# EAGLE board micromouse_board_revB_V0.0.16 (EAGLE 9.4.2)
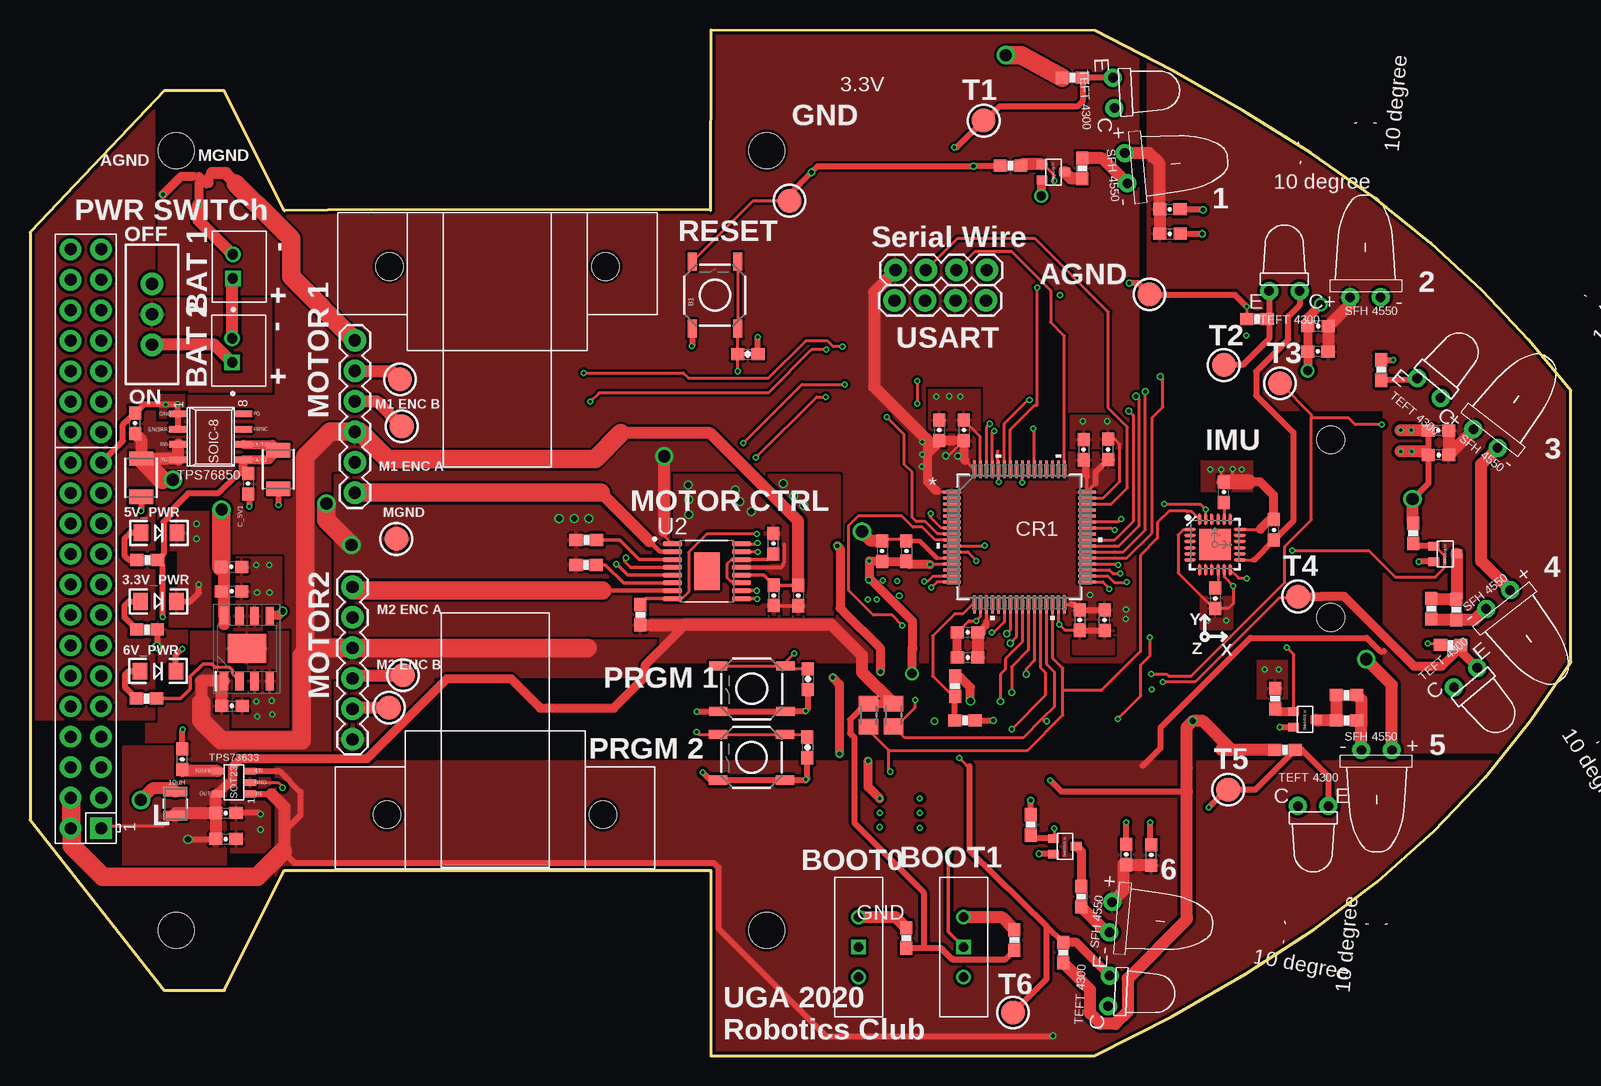
[diagram p5: board, top side]
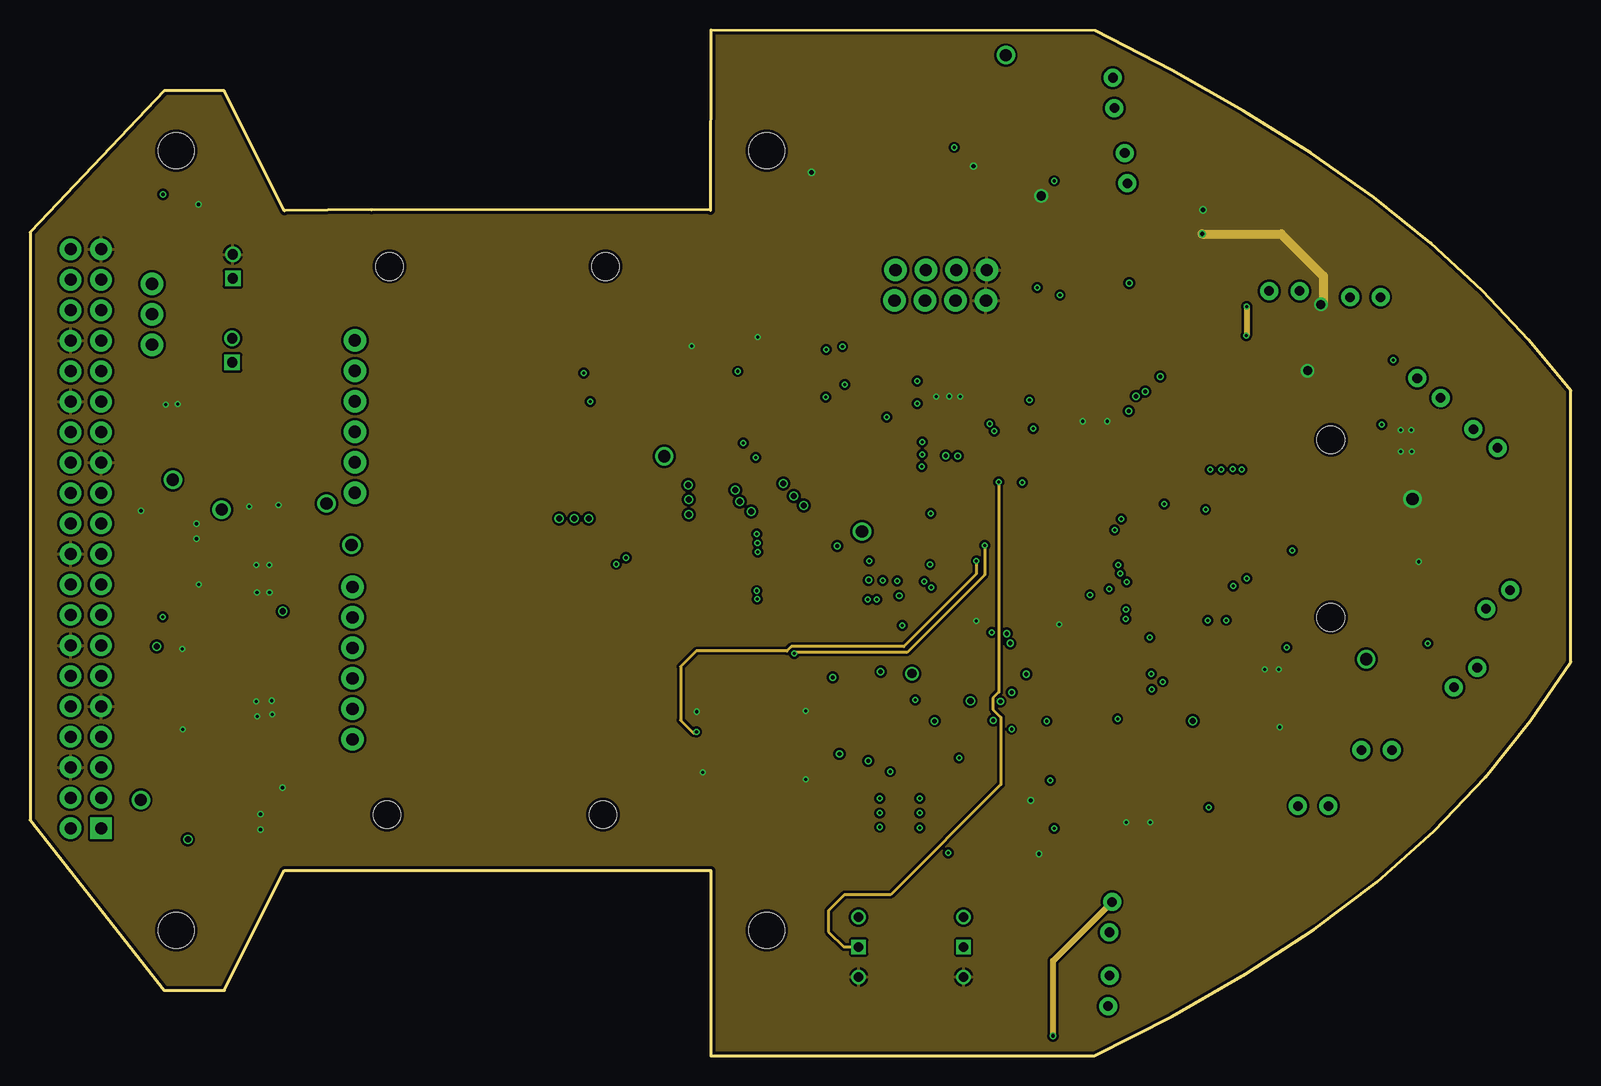
[diagram p6: board, inner layer GND]
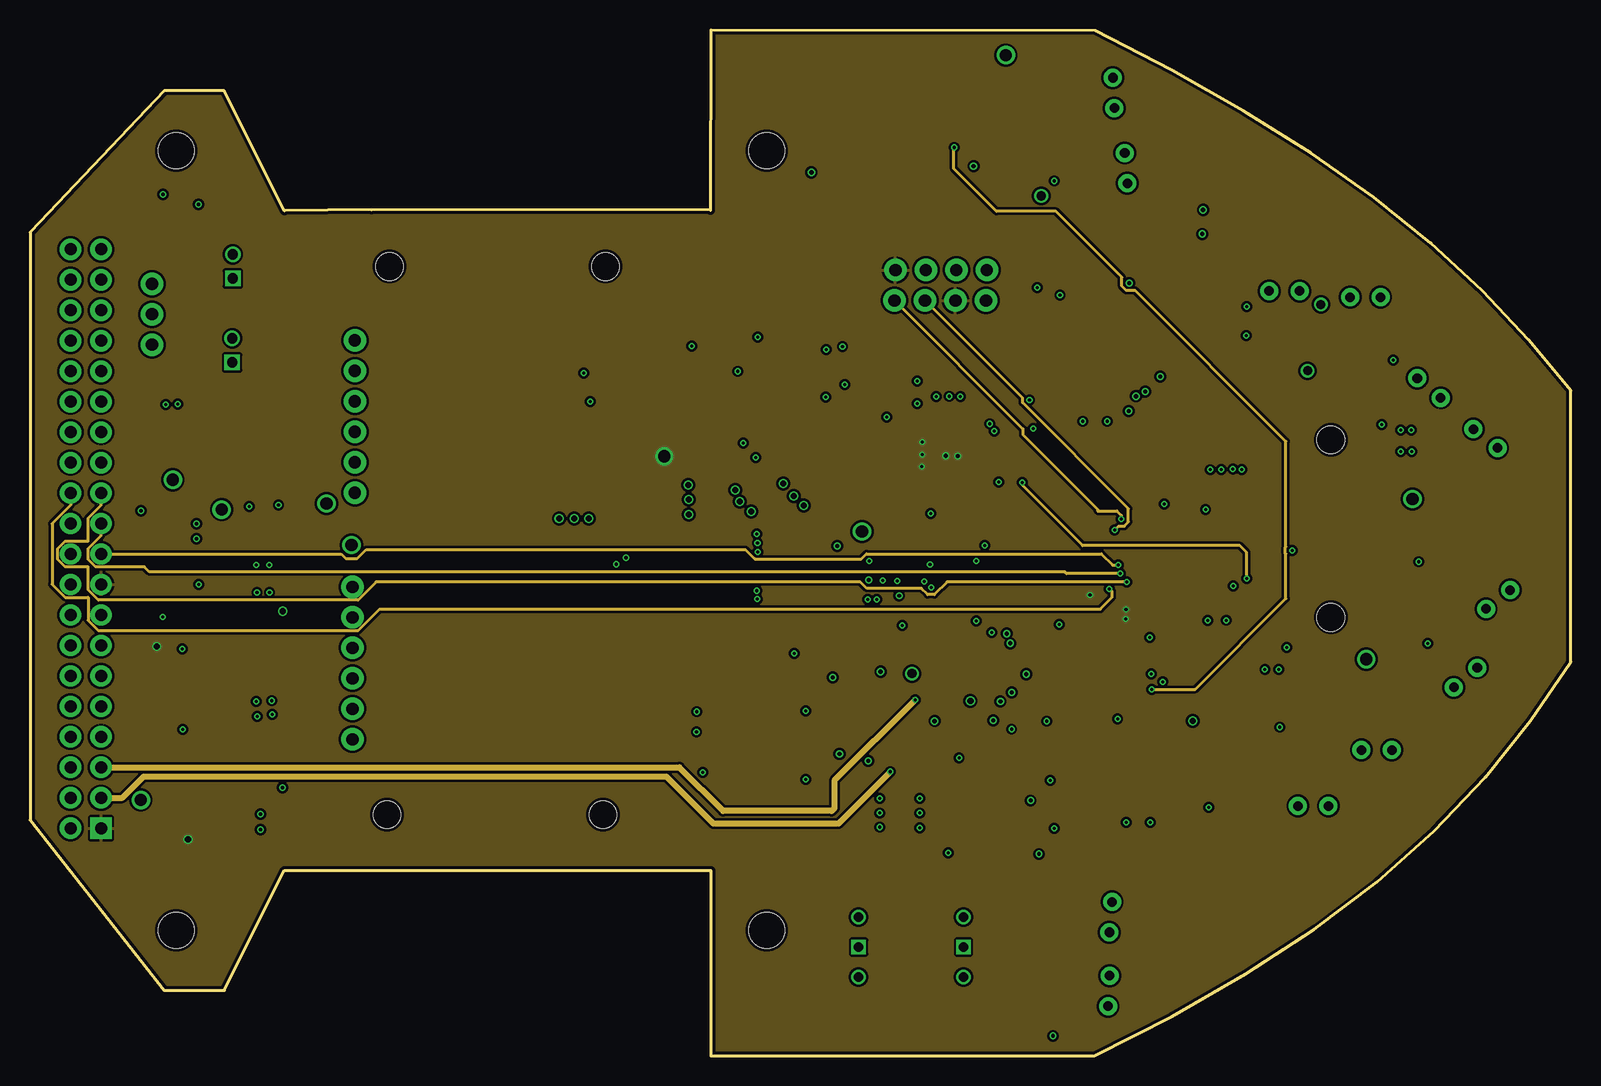
[diagram p7: board, inner layer SIGNAL]
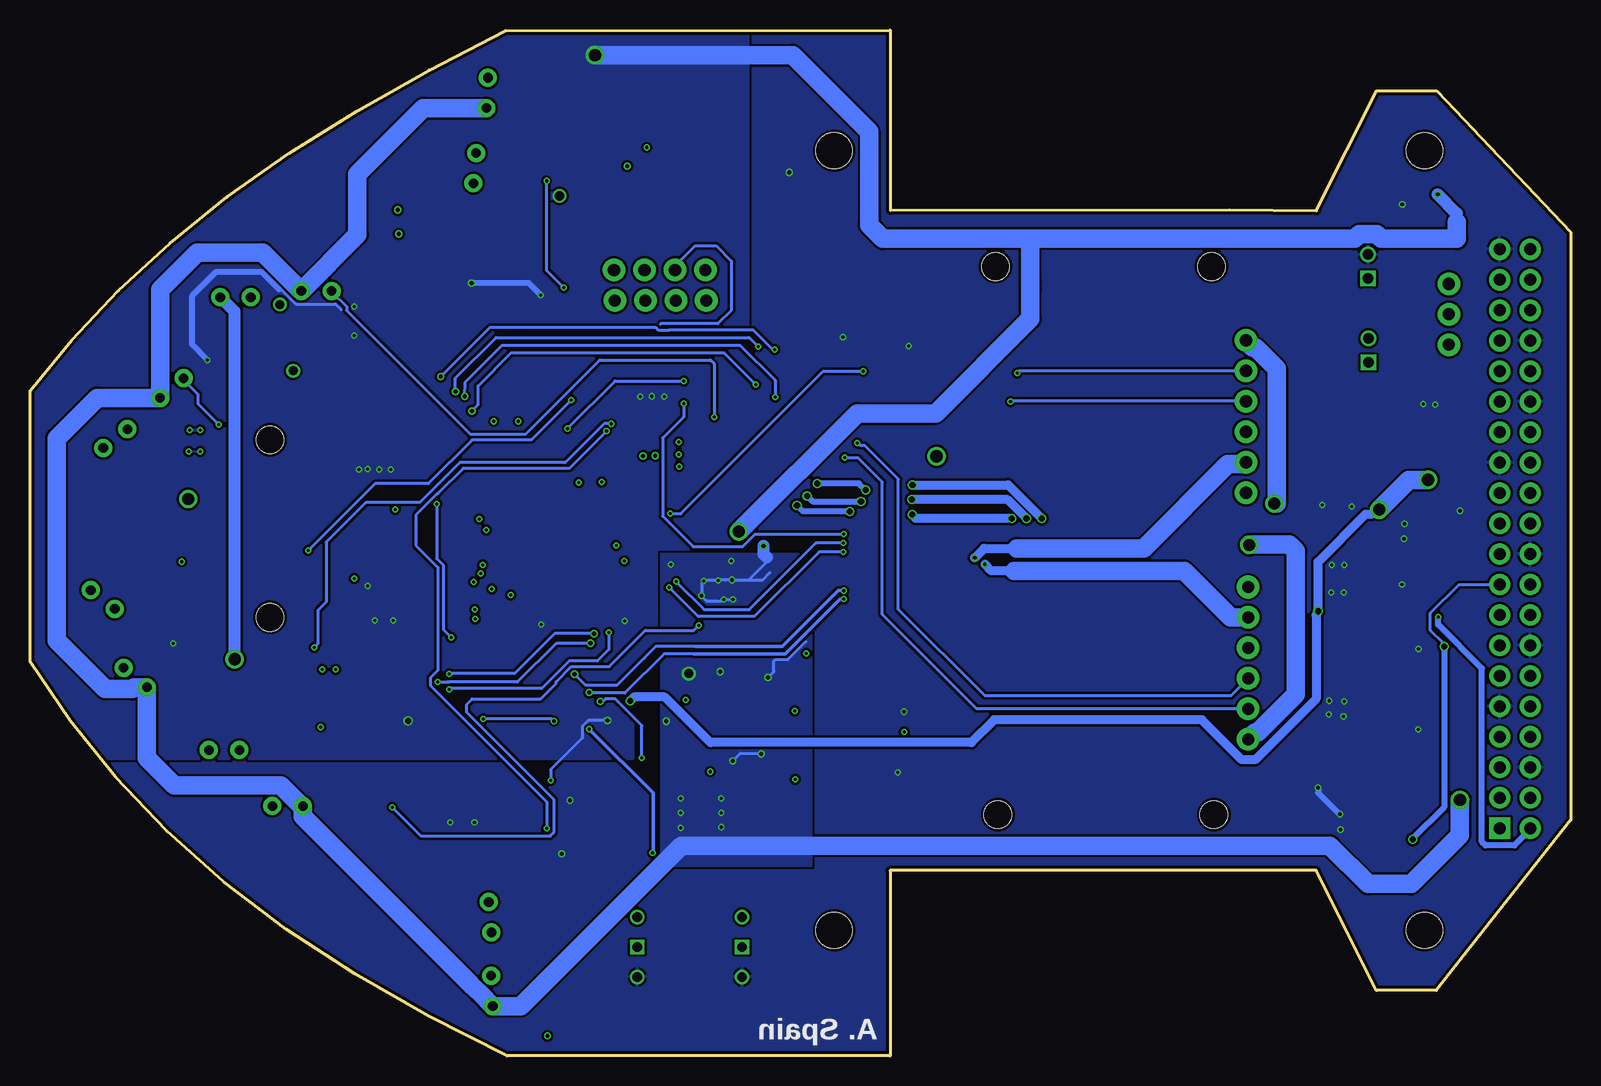
[diagram p8: board, bottom side, seen from below]

Size 128.4 x 85.52 mm. Coordinates in mm from the lower left corner, seen from the top.
Outline: 56.73,15.45 56.73,0 88.67,0 95.19,3.31 101.32,6.82 107.03,10.54 112.27,14.51 117.01,18.73 121.25,23.21 125.04,27.92 128.4,32.85 128.4,55.45 124.91,59.68 121.03,63.79 116.73,67.75 111.98,71.57 106.78,75.24 101.15,78.77 95.14,82.18 88.79,85.47 56.73,85.52 56.71,70.48 28.44,70.53 21.2,70.45 16.19,80.45 11.18,80.45 0,68.65 0,19.65 11.2,5.45 16.2,5.45 21.2,15.45 56.73,15.45
Copper layers (1+2*3+16): PWR 0.018mm / dielectric 0.36mm / GND 0.035mm / dielectric 0.71mm / SIGNAL 0.035mm / dielectric 0.36mm / AGROUND 0.018mm
Design rules "eC_4Layer_PClass6_BaseCopperO18-I35_eCDefault *": minimum track width 10mil, minimum drill 10mil, track to track 0.15mm, track to pad 0.15mm, pad to pad 0.15mm, via to via 0.15mm, smd to smd 0mil, copper to edge 0.25mm, drill to drill 0.35mm, minimum pad ring 0.175mm, minimum via ring 0.125mm, stop-mask expansion 0mil, vias tented up to drill 0.45mm, thermal gap 0.2mm
Net classes: 0 default: width 0.254 mm, drill 0.254 mm, clearance 0.203 mm; 1 5V: width 0.508 mm, drill 0.254 mm, clearance 0.254 mm; 2 6V: width 0.305 mm, drill 0.305 mm, clearance 0.203 mm; 3 6V_S: width 0.229 mm, drill 0.203 mm, clearance 0.203 mm; 4 V_BATT: width 0.762 mm, drill 0.508 mm, clearance 0.254 mm; 5 3.3V: width 0.254 mm, drill 0.254 mm, clearance 0.203 mm; 6 MGND: width 0.305 mm, drill 0.305 mm, clearance 0.254 mm; 7 AGND: width 0.254 mm, drill 0.203 mm, clearance 0.203 mm; 8 GND: width 0.254 mm, drill 0.203 mm, clearance 0.203 mm; 9 M1: width 0.254 mm, drill 0.254 mm, clearance 0.203 mm; 10 M2: width 0.254 mm, drill 0.254 mm, clearance 0.203 mm
Holes 3 mm at 12.2,10.45 12.2,75.45 61.4,10.45 61.4,75.45
Holes 2.3 mm at 108.4,36.55 108.4,51.35 29.75,20.1 47.75,20.1 47.95,65.8 29.95,65.8
tKeepout: area 34.3,15.9 to 43,36.9; area 34.5,49.3 to 43.2,70.3

## Footprints (pad centres in the part's own frame; a part is rotated, then mirrored left to right if it is on the bottom)
LED-1206 = smd 1.2 x 1.4: A -1.5,0; C 1.5,0
TACTILE-SWITCH-SMD = smd 1.524 x 0.762: 1 -2.794,1.905; 2 2.794,1.905; 3 -2.794,-1.905; 4 2.794,-1.905
0603-CAP = smd 1.1 x 1: 1 -0.85,0; 2 0.85,0
1210 = smd 1.2 x 2: 1 -1.6,0; 2 1.6,0
LQFP-64 = smd 1.473 x 0.229: 1 -5.626,3.75; 2 -5.626,3.25; 3 -5.626,2.75; 4 -5.626,2.25; 5 -5.626,1.75; 6 -5.626,1.25; 7 -5.626,0.75; 8 -5.626,0.25; 9 -5.626,-0.25; 10 -5.626,-0.75; 11 -5.626,-1.25; 12 -5.626,-1.75; 13 -5.626,-2.25; 14 -5.626,-2.75; 15 -5.626,-3.25; 16 -5.626,-3.75; 33 5.626,-3.75; 34 5.626,-3.25; 35 5.626,-2.75; 36 5.626,-2.25; 37 5.626,-1.75; 38 5.626,-1.25; 39 5.626,-0.75; 40 5.626,-0.25; 41 5.626,0.25; 42 5.626,0.75; 43 5.626,1.25; 44 5.626,1.75; 45 5.626,2.25; 46 5.626,2.75; 47 5.626,3.25; 48 5.626,3.75 | smd 0.229 x 1.473: 17 -3.75,-5.626; 18 -3.25,-5.626; 19 -2.75,-5.626; 20 -2.25,-5.626; 21 -1.75,-5.626; 22 -1.25,-5.626; 23 -0.75,-5.626; 24 -0.25,-5.626; 25 0.25,-5.626; 26 0.75,-5.626; 27 1.25,-5.626; 28 1.75,-5.626; 29 2.25,-5.626; 30 2.75,-5.626; 31 3.25,-5.626; 32 3.75,-5.626; 49 3.75,5.626; 50 3.25,5.626; 51 2.75,5.626; 52 2.25,5.626; 53 1.75,5.626; 54 1.25,5.626; 55 0.75,5.626; 56 0.25,5.626; 57 -0.25,5.626; 58 -0.75,5.626; 59 -1.25,5.626; 60 -1.75,5.626; 61 -2.25,5.626; 62 -2.75,5.626; 63 -3.25,5.626; 64 -3.75,5.626
1X04 = drill 1.016 pad 1.88: 1 0,0; 2 2.54,0; 3 5.08,0; 4 7.62,0
JST_B2B-PH-K-S(LF)(SN) = drill 0.86 square: 1 1,-0.55 | drill 0.86: 2 -1,-0.55
1007 = smd 2 x 0.8: 1 0,1; 2 0,-1
EMITTER = drill 0.8 pad 1.5: + -1.27,-0.5; - 1.27,-0.5
DMN3150LW = smd 0.7 x 0.9: D 0,0.95; G -0.65,-0.95; S 0.65,-0.95
M0805 = smd 1.3 x 1.6: 1 -0.95,0; 2 0.95,0
0603-RES = smd 1.1 x 1: 1 -0.85,0; 2 0.85,0
RECEIVER = drill 0.8 pad 1.5: C 1.27,-0.5; E -1.27,-0.5
SWITCH-SPDT = drill 1.016 pad 1.88: 1 0,2.54; 2 0,0; 3 0,-2.54
TESTPOINT_ROUND_2MM = smd 2 x 2: P$1 0,0
SOP65P640X120-17N = smd 1.57 x 0.41: 1 -2.87,2.275; 2 -2.87,1.625; 3 -2.87,0.975; 4 -2.87,0.325; 5 -2.87,-0.325; 6 -2.87,-0.975; 7 -2.87,-1.625; 8 -2.87,-2.275; 9 2.87,-2.275; 10 2.87,-1.625; 11 2.87,-0.975; 12 2.87,-0.325; 13 2.87,0.325; 14 2.87,0.975; 15 2.87,1.625; 16 2.87,2.275 | smd 2.105 x 3.115: 17 0,0
QFN-24-EP = smd 1.016 x 0.254: 1 -2.066,1.257; 2 -2.066,0.75; 3 -2.066,0.247; 4 -2.066,-0.287; 5 -2.066,-0.792; 6 -2.066,-1.297; 13 2.086,-1.297; 14 2.086,-0.792; 15 2.086,-0.287; 16 2.086,0.247; 17 2.086,0.75; 18 2.086,1.257 | smd 0.254 x 1.016: 7 -1.267,-2.122; 8 -0.762,-2.122; 9 -0.258,-2.122; 10 0.278,-2.122; 11 0.78,-2.122; 12 1.287,-2.122; 19 1.287,2.082; 20 0.78,2.082; 21 0.278,2.082; 22 -0.258,2.082; 23 -0.762,2.082; 24 -1.267,2.082 | smd 2.616 x 2.616: P$1 0.02,-0.01
TPS73633(SOT-23) = smd 0.55 x 1: EN 0.95,-1.35; GND 0,-1.35; IN -0.95,-1.35; NR/FB 0.95,1.35; OUT -0.95,1.35
TPS76850(SOIC-8) = smd 0.55 x 1.5: EN(BAR) -0.635,-2.7; FB/NC -0.635,2.7; GND -1.905,-2.7; IN1 0.635,-2.7; IN2 1.905,-2.7; OUT1 0.635,2.7; OUT2 1.905,2.7; PG -1.905,2.7
6P_HEADER = drill 1.016 pad 1.88: 1 0,0; 2 2.54,0; 3 5.08,0; 4 7.62,0; 5 10.16,0; 6 12.7,0
SPDT = drill 0.8: P$1 -2.5,0; P$3 2.5,0 | drill 0.8 square: P$2 0,0
SPLITTER = smd 0.102 x 0.102: 1 0,0; 2 0,0
SOIC127P600X100-9N = smd 1.525 x 0.7: 1 -2.712,1.905; 2 -2.712,0.635; 3 -2.712,-0.635; 4 -2.712,-1.905; 5 2.712,-1.905; 6 2.712,-0.635; 7 2.712,0.635; 8 2.712,1.905 | smd 2.4 x 3.2: 9 0,0
RASPI_GPIO_B+_PIN = drill 1 pad 1.778 square: 1 -24.13,-1.27 | drill 1 pad 1.778: 2 -24.13,1.27; 3 -21.59,-1.27; 4 -21.59,1.27; 5 -19.05,-1.27; 6 -19.05,1.27; 7 -16.51,-1.27; 8 -16.51,1.27; 9 -13.97,-1.27; 10 -13.97,1.27; 11 -11.43,-1.27; 12 -11.43,1.27; 13 -8.89,-1.27; 14 -8.89,1.27; 15 -6.35,-1.27; 16 -6.35,1.27; 17 -3.81,-1.27; 18 -3.81,1.27; 19 -1.27,-1.27; 20 -1.27,1.27; 21 1.27,-1.27; 22 1.27,1.27; 23 3.81,-1.27; 24 3.81,1.27; 25 6.35,-1.27; 26 6.35,1.27; 27 8.89,-1.27; 28 8.89,1.27; 29 11.43,-1.27; 30 11.43,1.27; 31 13.97,-1.27; 32 13.97,1.27; 33 16.51,-1.27; 34 16.51,1.27; 35 19.05,-1.27; 36 19.05,1.27; 37 21.59,-1.27; 38 21.59,1.27; 39 24.13,-1.27; 40 24.13,1.27

## Placement (x,y rotation side)
3.3V_PWR  green  [LED-1206]  10.71,37.89 0 top
5V_PWR  green  [LED-1206]  10.74,43.6 0 top
6V_PWR  green  [LED-1206]  10.66,32.07 0 top
B1  [TACTILE-SWITCH-SMD]  57.08,63.41 90 top
B2  [TACTILE-SWITCH-SMD]  60.16,30.6 180 top
B3  [TACTILE-SWITCH-SMD]  60.12,24.89 180 top
C1  10nF  [0603-CAP]  73.04,42.08 270 top
C2  4.7uF  [0603-CAP]  75.77,52.15 270 top
C4  0.1uF  [0603-CAP]  77.82,52.15 270 top
C7  0.1uF  [0603-CAP]  87.48,36.33 270 top
C8  1uF  [0603-CAP]  71.01,42.07 270 top
C17  0.1uF  [0603-CAP]  78.13,35.3 180 top
C18  4.7uF  [0603-CAP]  78.14,33.21 0 top
C21  4.7uF  [0603-CAP]  89.54,36.32 90 top
C22  0.1uF  [0603-CAP]  89.85,50.56 90 top
C23  4.7uF  [0603-CAP]  87.79,50.53 270 top
C_3.3V1  10uF  [0603-CAP]  16.32,20.24 0 top
C_3.3V2  0.1uF  [0603-CAP]  16.32,18.07 0 top
C_3.3V5  1uF  [0603-CAP]  16.83,29.17 0 top
C_3.3V6  10uF  [0603-CAP]  16.79,40.77 0 top
C_3.3V7  0.1uF  [0603-CAP]  16.8,38.72 0 top
C_5V1  0.1uF  [0603-CAP]  18.17,47.7 270 top
C_5V2  47uF  [1210]  20.7,48.88 270 top
C_BAT1  0.1uF  [0603-CAP]  8.75,52.73 90 top
C_BAT2  47uF  [1210]  9.25,48.19 270 top
C_D  0.1uF  [0603-CAP]  61.98,38.38 270 top
C_D1  10uF  [0603-CAP]  64.02,38.37 270 top
C_D2  2.2uF  [0603-CAP]  61.95,42.69 90 top
C_E_H1  4.7uF  [0603-CAP]  107.33,60.83 180 top
C_E_H2  0.1uF  [0603-CAP]  107.32,58.73 180 top
C_ELF1  4.7uF  [0603-CAP]  95,68.52 0 top
C_ELF2  0.1uF  [0603-CAP]  94.99,70.57 0 top
C_EM_D1  4.7uF  [0603-CAP]  117.38,50.08 180 top
C_EM_D2  0.1uF  [0603-CAP]  117.37,52.14 180 top
C_ERF1  4.7uF  [0603-CAP]  91.36,16.79 90 top
C_ERF2  0.1uF  [0603-CAP]  93.44,16.74 90 top
C_NR  0.1uF  [0603-CAP]  12.69,24.72 90 top
C_NRST  0.1uF  [0603-CAP]  59.82,58.5 0 top
C_NRST1  0.1uF  [0603-CAP]  64.83,31.4 270 top
C_NRST2  0.1uF  [0603-CAP]  64.79,25.71 270 top
CR1  STM32F103RET6  [LQFP-64]  82.45,43.26 0 top
IMU_C1  0.1uF  [0603-CAP]  98.77,38.14 270 top
IMU_C2  0.1uF  [0603-CAP]  103.66,43.85 90 top
IMU_C3  2.2nF  [0603-CAP]  99.5,46.99 90 top
J1  [1X04]  79.74,65.51 180 top
J2  JST_PH  [JST_B2B-PH-K-S(LF)(SN)]  17.45,65.8 270 top
J3  JST_PH  [JST_B2B-PH-K-S(LF)(SN)]  17.4,58.8 270 top
J4  [1X04]  79.66,62.96 180 top
L1  10uH  [1007]  12.12,21.02 180 top
LEFT_FRONT_EMITTER  EMITTER  [EMITTER]  91.83,74.05 275 top
NMOS1  DMN3150LW  [DMN3150LW]  85.28,73.67 270 top
NMOS2  DMN3150LW  [DMN3150LW]  117.94,41.84 270 top
NMOS3  DMN3150LW  [DMN3150LW]  86.24,17.47 270 top
NMOS4  DMN3150LW  [DMN3150LW]  106.24,28.04 270 top
R4  4.7k  [M0805]  71.96,28.41 90 top
R5  4.7k  [M0805]  69.87,28.4 90 top
R_B1  47k  [0603-RES]  73.01,9.82 270 top
R_B2  47k  [0603-RES]  82.04,9.64 270 top
R_ED1  5.6  [0603-RES]  116.77,37.27 270 top
R_ED2  5.6  [0603-RES]  118.86,37.19 270 top
R_ED_PD  47k  [0603-RES]  115.25,43.55 270 top
R_EH1  5.6  [0603-RES]  109.7,27.95 0 top
R_EH2  5.6  [0603-RES]  109.71,30.06 0 top
R_EH_PD  47k  [0603-RES]  103.75,29.77 270 top
R_ELF  10  [0603-RES]  87.68,73.98 90 top
R_ELF_PD  47k  [0603-RES]  81.71,74.2 0 top
R_ERF  10  [0603-RES]  87.61,13.27 270 top
R_ERF_PD  47k  [0603-RES]  83.41,19.25 270 top
R_PWR1  150 Ohm  [0603-RES]  9.77,41.34 0 top
R_PWR3  150 Ohm  [0603-RES]  9.7,29.78 0 top
R_PWR4  150 Ohm  [0603-RES]  9.75,35.52 0 top
R_RLD  1.8k  [0603-RES]  112.59,57.17 270 top
R_RLF  1.8k  [0603-RES]  86.86,81.55 0 top
R_RLH  1.8k  [0603-RES]  102.24,61.43 0 top
R_RRD  1.8k  [0603-RES]  118.38,34.23 0 top
R_RRF  1.8k  [0603-RES]  86.1,8.61 90 top
R_RRH  1.8k  [0603-RES]  104.59,25.51 0 top
R_VM1  75k  [0603-RES]  77.09,30.8 90 top
R_VM2  50k  [0603-RES]  77.9,27.96 180 top
R_VM3  500m  [0603-RES]  46.35,40.93 180 top
R_VM4  500m  [0603-RES]  46.36,42.99 180 top
R_VM5  10k  [0603-RES]  50.87,36.78 270 top
REC_LF  RECEIVER  [RECEIVER]  90.8,80.3 273 top
S2  [SWITCH-SPDT]  10.16,61.82 0 top
T1  [TESTPOINT_ROUND_2MM]  79.47,77.96 90 top
T2  [TESTPOINT_ROUND_2MM]  99.49,57.59 90 top
T3  [TESTPOINT_ROUND_2MM]  104.17,56.07 90 top
T4  [TESTPOINT_ROUND_2MM]  105.67,38.29 90 top
T5  [TESTPOINT_ROUND_2MM]  99.85,22.18 90 top
T6  [TESTPOINT_ROUND_2MM]  81.93,3.61 90 top
TP7  [TESTPOINT_ROUND_2MM]  30.98,52.47 0 top
TP8  [TESTPOINT_ROUND_2MM]  30.83,56.41 0 top
TP9  [TESTPOINT_ROUND_2MM]  31.08,31.72 0 top
TP10  [TESTPOINT_ROUND_2MM]  29.91,29.03 0 top
TP11  [TESTPOINT_ROUND_2MM]  30.52,43.09 0 top
TP12  [TESTPOINT_ROUND_2MM]  93.3,63.47 90 top
TP13  [TESTPOINT_ROUND_2MM]  63.29,71.29 90 top
U2  DRV8848PWPR  [SOP65P640X120-17N]  56.41,40.4 0 top
U6  MPU-6000  [QFN-24-EP]  98.73,42.64 0 top
U$3  TPS73633(SOT-23)  [TPS73633(SOT-23)]  16.99,22.78 90 top
U$4  TPS76850(SOIC-8)  [TPS76850(SOIC-8)]  15.07,51.6 270 top
U$5  6P_HEADER  [6P_HEADER]  26.88,39.09 270 top
U$6  6P_HEADER  [6P_HEADER]  27.07,46.94 90 top
U$7  RECEIVER  [RECEIVER]  116.9,56.05 320 top
U$8  RECEIVER  [RECEIVER]  119.95,31.15 220 top
U$9  RECEIVER  [RECEIVER]  90.4,5.38 267 top
U$11  EMITTER  [EMITTER]  121.6,51.85 322 top
U$13  EMITTER  [EMITTER]  90.56,11.52 265 top
U$14  SPARKFUN-SPDT  [SPDT]  69.05,9.07 270 top
U$15  SPARKFUN-SPDT  [SPDT]  77.79,9.07 270 top
U$16  SPLITTER  [SPLITTER]  14.05,72.72 0 top
U$17  EMITTER  [EMITTER]  122.65,37.65 218 top
U$18  EMITTER  [EMITTER]  111.28,63.75 0 top
U$19  EMITTER  [EMITTER]  112.22,24.99 180 top
U$20  RECEIVER  [RECEIVER]  106.94,20.33 180 top
U$21  RECEIVER  [RECEIVER]  104.53,64.26 0 top
U$22  SPLITTER  [SPLITTER]  14.07,73.33 0 top
U$23  BD60HC5WEFJ  [SOIC127P600X100-9N]  18.08,33.95 90 top
X1  RASPI_GPIO_B+#_PIN  [RASPI_GPIO_B+_PIN]  4.65,43.1 90 top

## Tracks (layer width: path | path; a pad name or v marks a point on that pad's centre or on a via)
3.3V  (via drill 0.25, 0.35, 0.51, 1.02)
  PWR 0.254: CR1.1 75.69,47.01 | 79.7,36.31 CR1.19 79.7,36.18 | CR1.32 86.78,37.63 | 79.7,36.11 79.7,36.01 C17.1 | 75.91,8.96 76.15,8.96 76.95,8.16 | 73.13,8.96 R_B1.2 | 52.83,43.57 52.81,43.57 52.83,43.78 | X1.1 5.98,19.12 11.06,19.12 11.7,19.76 L1.1 | C18.2 79.01,33.25 79.09,33.31 | C7.1 87.74,37.38 87.74,37.28 | CR1.64 77.92,49.66 77.92,49.72 | U2.1 52.83,43.38 52.83,43.78 | C2.2 C4.2 76.55,50.03 v76.3,50.03
  PWR 0.305: 88.81,47.75 CR1.48 88.07,48.32 | 87.94,49.53 C23.2
  PWR 0.508: L1.1 11.88,19.78 | R_PWR4.2 10.6,34.29 10.61,34.28 10.61,34.18 v10.56,34.13 | v13.16,18.04 15.44,18.04 C_3.3V2.1 | 52.83,43.57 52.83,43.78 | C21.2 89.54,37.18 C7.1 87.03,37.63 86.78,37.63 | 75.69,47.01 75.63,47.01 75.5,47.14 | 87.94,49.53 87.94,48.46 88.07,48.32 88.07,49.4 C23.2 | 88.81,47.75 88.81,48.67 C22.1 | C17.1 79.7,36.02 | 79.7,36.02 79.7,36.11 79.7,36.18 | 79.18,35.3 79.7,35.82 79.7,36.02 | 76.9,8.11 77,8.01 | R_B2.2 81.25,8.01 77,8.01 | 77,8.01 76.87,8.01 75.91,8.96 74.47,8.96 | 74.47,8.96 73.13,8.96 | R5.2 69.85,29.37 69.69,29.37 68.34,28.01 68.34,26.89 68.69,26.53 68.69,19.42 70.74,17.36 70.72,17.36 74.47,13.62 74.47,8.96 | 35.63,31.42 35.53,31.32 | v74.34,51.17 74.67,51.17 74.8,51.3 | v74.34,50.13 74.75,50.13 74.8,50.18 | v74.31,49.14 74.75,49.14 74.8,49.19
  PWR 0.762: 75.12,50.98 75.45,50.98 C2.2 77.05,51.3 | 75.5,47.14 74.8,47.84 74.8,49.19 74.8,50.18 | 74.8,50.18 74.8,51.3 | R4.2 R5.2 | 54.6,35.93 51.27,32.6 51.27,31.61 48.66,29 42.51,29 40.09,31.42 35.63,31.42 34.74,31.42 28.08,24.76 17.52,24.76 16.88,24.13 16.88,22.7 16.5,22.7 U$3.OUT | 74.8,50.18 75.92,51.3 C4.2 77.82,49.76 77.92,49.66
  PWR 1.016: J1.4 72.12,65.44 70.34,63.67 70.34,55.76 74.8,51.3 75.12,50.98 | C_3.3V1.1 C_3.3V2.1 | L1.1 12.12,20.24 C_3.3V1.1 | 52.83,49.8 52.83,43.78 | R_VM5.2 54.6,35.93 66.79,35.93 69.32,33.41 69.32,32 R4.2 | 79.18,35.3 C17.1 C18.2 | C_3.3V1.1 15.47,21.66 U$3.OUT
  AGROUND 0.254: X1.17 5.98,39.28 9.31,39.28 11.7,36.9 11.7,35.47 10.58,34.36 v10.56,34.13
  AGROUND 0.508: v10.56,34.13 10.56,20.72 13.2,18.07 v13.16,18.04
  other vias: 52.85,49.98 88.33,38.42 91.33,37.22 91.31,36.41 77.31,50
  pour PWR (rank 3): 14.6,22.98 14.6,20.51 10.38,20.51 10.38,12.97 16.2,12.97 16.2,22.98
  pour PWR (rank 3): 7.26,93.01 7.26,32.83 92.37,32.83 92.37,93.01
  pour PWR: 7.92,25.67 16.15,25.67 16.15,2.33 7.92,2.33
  pour SIGNAL: -8.57,98.67 -8.57,-7.94 65.55,-7.94 141.45,-7.94 141.45,100.47 -8.57,100.47
5V  (via drill 0.25, 0.3)
  PWR 0.508: U$3.IN 19.79,21.83 19.79,21.82 20.14,21.8 | C_5V1.1 17.33,48.55 15.66,46.88 13.18,46.88 11.8,45.51 11.8,45.19 11.13,44.51 11.13,41.85 R_PWR1.2 10.74,41.19 11.06,40.87 v11.06,36.58 | X1.4 3.44,21.5 3.44,19.12 X1.2 3.44,18.8 | 20.27,16.26 21.06,17.06 22.04,16.08 56.99,16.08 57.36,15.71 57.36,10.63 66.35,1.64 85.26,1.64 v85.26,1.67 | 112.82,33.73 112.5,33.73 111.39,34.84 101.71,34.84 94.19,27.33 94.19,25.64 92.73,24.17 | U$3.EN 20.8,23.73 22.52,22.01 22.52,20.05 21.35,18.89 21.23,18.89 | 20.43,15.95 20.19,16.18
  PWR 0.762: 20.11,50.48 C_5V2.1 | U$4.OUT1 20.21,50.97 C_5V2.1 | C_5V2.1 19.91,49.7 U$4.OUT2 17.77,48.95 C_5V1.1
  PWR 1.016: C_EM_D2.1 118.23,52.13 C_EM_D1.1 120.29,52.14 U$11.+ | C_ERF2.1 93.44,15.94 C_ERF1.1 91.28,16.01 91.11,16.01 91.11,13.77 U$13.+ | U$18.+ 110.01,62.65 C_E_H1.1 108.18,58.74 C_E_H2.1 | LEFT_FRONT_EMITTER.+ 93.24,75.27 94.14,74.37 C_ELF2.1 C_ELF1.1 | 21.06,17.06 21.23,17.22 21.23,18.89 21.23,20.72 20.14,21.8
  PWR 1.524: X1.4 3.44,21.45 3.44,18.8 | X1.2 3.48,18.87 3.48,17.48 6.04,14.92 18.93,14.92 20.19,16.18 21.06,17.06
  GND 0.508: v85.26,1.67 85.26,7.92 U$13.+
  AGROUND 0.508: v11.06,36.58 11.06,35.95 7.41,32.3 7.41,17.85 7.09,17.53 4.71,17.53 3.28,18.96 X1.2
  pour PWR: 20.49,24.55 20.49,-3.9 134.64,-3.9 134.64,24.55
  pour PWR: 93.16,86.36 93.16,53.89 112.82,53.89 112.82,25.34 131.92,25.34 131.92,86.9
6V
  PWR 0.305: U2.12 61.14,40.07 C_D.1 61.99,39.22 C_D1.1
  PWR 0.762: 14.27,29.83 14.27,29.47
  PWR 1.016: 14.27,29.83 14.27,31.24 U$23.1 15.98,31.24 C_3.3V5.1 | C_D1.1 64.02,44.57 56.69,51.91 49.24,51.91
  PWR 1.524: 14.27,29.47 14.27,27.98 15.94,26.3 22.65,26.3 22.65,33.35 22.93,33.63 | 22.93,33.63 23.3,34.01 U$5.3 46.47,34.01 | 22.93,33.63 22.93,49.95 25,52.02 U$6.3 27.48,52.02 29.76,49.75 47.08,49.75 49.24,51.91
  pour PWR (rank 4): 9.69,87.51 9.69,-3.9 33.6,-3.9 33.6,89.02 9.85,89.02
  pour PWR: 25.19,34.48 74.39,34.48 74.39,31.71 25.16,31.71 25.16,34.48
6V_S
  PWR 0.254: U$23.2 16.9,31.78 16.9,32.16 16.68,32.38 15.43,32.38
  PWR 0.305: R_PWR3.2 12.56,29.78 13.35,30.57 13.35,31.62 13.89,32.15 13.94,32.15 14.44,32.65 15.16,32.65 15.43,32.38
A3.3V  (via drill 0.25, 0.3, 0.35, 0.76, 1.02)
  PWR 0.254: CR1.13 76.77,40.96 v75,40.96 | 102.18,57.06 104.82,59.7 104.88,59.76 104.88,61.69 | 103.77,43.09 IMU_C2.1 | U6.13 102,41.34 | 67.65,37.19 67.73,37.1
  PWR 0.305: 73.23,41.01 73.16,41.08 73.16,41.1 C1.2
  PWR 0.508: 102,41.34 IMU_C2.1 | U$21.C 105.8,62.6 104.88,61.69 104.82,61.62 104.82,59.7 | 104.88,59.76 102.18,57.06 102.18,55.06 105.28,51.96 105.28,44.6 103.77,43.09
  PWR 0.762: C1.2 C8.2 70.97,41.26 v69.94,41.26 69.94,39.82 73.52,36.24 73.52,34 | v75,40.96 73.28,40.96 73.16,41.08 | v67.28,42.51 67.5,42.29 67.5,37.33 67.65,37.19 | 67.73,37.1 70.88,33.95 70.88,32.04 | v66.9,31.54 67.46,30.98 v67.46,25.17 | 73.52,34 73.58,33.95 | v73.5,31.87 73.5,33.98 73.52,34 | v70.81,21.45 69.84,22.42 v69.84,24.58
  PWR 1.016: L1.2 11.85,22.29 10.2,22.29 v9.24,21.32
  AGROUND 0.254: v69.84,24.58 69.21,25.21 67.46,25.21 v67.46,25.17 | v66.9,31.54 66.41,32.02 66.41,32.91 66.29,33.03 65.25,33.03 63.75,34.53 | v69.89,39.66 67.35,39.66 66.74,40.27 | v69.89,39.66 68.52,39.66 67,41.19 67,41.54 | v69.89,39.66 71.04,39.66 v71.06,39.64 72.2,39.64 v72.26,39.59 72.43,39.41 v72.43,38.34 72.03,37.94 70.68,37.94 v70.58,38.04 v69.82,38.04
  AGROUND 1.016: v67.28,42.51 67.28,41.82 67,41.54
  AGROUND 1.524: v9.24,21.32 9.24,18.38 13.3,14.31 16.88,14.31 20.08,17.51 74.11,17.51 87.48,4.14 U$9.C 90.93,5.23 91.65,5.88 91.65,5.95 105.67,19.97 U$20.C 105.78,20.83 107.5,22.54 116.37,22.54 118.66,24.82 U$8.C 119.73,30.72 119.87,30.58 122.13,30.58 126.18,34.63 126.18,51.47 122.8,54.85 U$7.C 117.55,63.86 114.45,66.97 109,66.97 U$21.C 101.11,68.45 101.11,73.52 95.62,79.01 REC_LF.C
  other vias: 70.81,20.23 70.81,19.06 74.16,21.45 74.16,20.23 74.16,19.01 75.38,27.9 70.88,32.02
  pour AGROUND: 63.29,41.85 75.79,41.85 75.79,15.84 63.29,15.84
AGND  (via drill 0.25, 0.3, 0.35, 0.51, 1.02)
  PWR 0.254: 75.55,41.51 CR1.12 | 101.39,43.89 U6.18 102.51,43.89 102.53,43.92 | 103.77,25.63 R_RRH.1 | v116.47,34.36 117.42,34.36 R_RRD.1 | v101.39,62.46 101.39,61.51 R_RLH.1 | C1.1 72.46,43.09 71.23,43.09 C8.1 | 103.27,44.65 103.29,44.68 IMU_C2.2 | 92.34,64.43 93.17,63.6 TP12.P$1 100.38,63.47 100.39,63.46 | U6.1 96.61,43.84 96.09,43.84 95.68,43.43 95.68,40.25 98.63,37.29 IMU_C1.2 99.86,37.29 100.27,37.71 v100.27,39.18 99.51,39.95 U6.11 | v99.28,48.88 99.28,48.05 IMU_C3.2 100.25,48.59 v100.25,48.91 | 96.18,23.4 96.18,23.74 96.41,23.97 | 11.09,71.85 v11.09,71.82
  PWR 0.305: 13.61,73.33 U$22.2
  PWR 0.381: C1.1 74.13,42.93 75.55,41.51
  PWR 0.508: R_VM2.1 v80.28,27.96 | 96.41,11.62 96.41,11.38 | v101.39,62.46 100.42,63.43 | 100.42,63.43 100.39,63.46 | 100.42,63.43 93.34,63.43 93.17,63.6 | TP12.P$1 92.34,64.43 v91.61,64.43 | R_RLD.1 v113.61,58.02 v113.61,58.01 | 96.41,22.01 85.97,22.01 v85.01,22.98
  PWR 0.762: 102.53,43.92 103.27,44.65 | IMU_C2.2 103.62,44.73 103.62,46.72 102.51,47.84 101.57,47.84 | v11.09,71.82 12.61,73.33 13.61,73.33
  PWR 1.016: C1.1 73,42.89 | v69.33,43.71 69.33,43.66 70.07,42.92 C8.1 | R_RRH.1 100.15,25.51 | 99.24,25.51 100.15,25.51 | 96.41,11.62 96.41,22.01 96.41,23.97 96.41,27.42 v96.89,27.9 97.75,27.9 100.15,25.51 | R_RRF.1 88.35,5.51 88.35,3.52 89.22,2.65 90.46,2.65 91.46,3.66 91.46,6.43 96.41,11.38
  PWR 1.27: 101.57,47.84 IMU_C3.2
  PWR 1.524: R_RLF.1 82.59,83.43 v81.32,83.43
  GND 0.508: v101.39,62.46 101.39,60.03 v101.37,60.03
  AGROUND 0.254: 45.03,64.52 45.03,63.87 | 113.77,58.01 v113.61,58.01 | 102.48,62.19 102.96,62.67 106.25,62.67 108.9,65.32 109.03,65.32 | v80.28,27.96 81.89,27.96 82.38,27.47 82.38,26.5 85.01,23.86 v85.01,22.98
  AGROUND 0.305: 9.49,69.49 9.49,70.22
  AGROUND 0.508: v80.28,27.96 v80.28,27.95 | v85.83,63.41 86.85,64.43 v91.61,64.43 | v113.61,58.01 114.88,59.28 114.88,63.36 112.92,65.32 109.08,65.32 107.66,63.9
  AGROUND 1.016: 9.49,70.22 v11.09,71.82
  AGROUND 1.524: v81.32,83.43 64.84,83.43 58.47,77.05 58.47,69.26 57.32,68.11 45.03,68.11 | 45.03,68.11 18.01,68.11 17.61,68.51 16.19,68.51 15.79,68.11 9.49,68.11 9.49,69.49 | 45.03,68.11 45.03,64.52 45.03,63.87 45.03,61.46 52.93,53.56 59.48,53.56 v69.33,43.71
  other vias: 99.69,36.31 98.14,36.28 100.98,48.88 98.34,48.86
  pour AGROUND: 130.4,85.18 130.4,24.78 78.15,24.78 78.15,58.21 68.55,58.21 68.55,85.18
  pour PWR: 101.85,49.53 101.85,47.08 97.63,47.08 97.63,49.58
  pour PWR: 97.55,38.27 100.2,38.27 100.2,35.57 97.55,35.57
BOOT0  (via drill 0.25)
  PWR 0.254: 80.66,50.46 80.66,48.93 CR1.60 80.7,47.83 80.71,47.82 v80.74,47.85
  GND 0.254: v80.74,47.85 80.74,30.32 80.24,29.82 80.24,28.89 80.91,28.22 80.91,22.61 71.72,13.43 67.86,13.43 66.54,12.1 66.54,10.35 67.83,9.07 U$14.P$2
BOOT1  (via drill 0.25)
  PWR 0.254: CR1.28 84.2,32.36 84.6,31.95 84.6,30.04 v81.79,27.23
  PWR 0.305: v76.52,16.91 76.52,10.34 U$15.P$2
  AGROUND 0.305: v81.79,27.23 76.47,21.91 76.47,16.96 v76.52,16.91
BRIDGE_A_1  (via drill 0.25)
  PWR 0.254: U2.16 60.56,42.67 v60.62,42.74 | CR1.15 76.78,39.97 75.23,39.97 74.82,39.55 v74.53,39.55
  AGROUND 0.254: v60.62,42.74 62.91,42.74 68.45,37.2 72.23,37.2 74.53,39.5
  AGROUND 0.305: v74.53,39.55 74.53,39.5
BRIDGE_A_2  (via drill 0.25)
  PWR 0.254: CR1.16 75.6,39.51 v75.12,39.03 | U2.15 60.64,42.02
  PWR 0.305: v60.64,42.01 60.64,42.02
  AGROUND 0.254: v60.64,42.01 62.65,42.01 68.03,36.63 72.72,36.63 v75.12,39.03
BRIDGE_B_1  (via drill 0.25, 0.35)
  PWR 0.254: CR1.26 83.2,33.82 81.81,32.42 v81.81,30.3
  PWR 0.305: 59.43,38.12 U2.9 60.59,38.12 | 60.6,38.11 60.59,38.12 | 60.59,38.12 60.59,38.08 v60.6,38.07
  AGROUND 0.254: 73.07,33.52 75.56,33.52 78.78,30.3 | 78.78,30.3 78.84,30.24 | v81.81,30.3 78.78,30.3
  AGROUND 0.305: v60.6,38.07 60.9,38.07 65.45,33.52 73.07,33.52
BRIDGE_B_2  (via drill 0.25, 0.35)
  PWR 0.254: CR1.27 83.7,32.95 83,32.25 83,31.84 v83.03,31.81
  PWR 0.305: 59.31,38.73 U2.10 v60.57,38.77
  AGROUND 0.254: 72.92,34.13 76.24,34.13 77.21,33.16 79.44,30.93 82.14,30.93 v83.03,31.81
  AGROUND 0.305: v60.57,38.77 61.06,38.77 65.7,34.13 72.92,34.13
D2_EM
  PWR 1.016: U$17.- 120.41,36.34 R_ED2.2 116.84,36.34 R_ED1.2
D_EM
  PWR 1.016: U$17.+ 120.92,41.24 120.92,49.31 U$11.-
EM_D  (via drill 0.25)
  PWR 0.254: CR1.59 81.2,52.69 | 81.2,52.69 | 81.2,52.69 83.21,54.7 v83.29,54.68 | v105.2,42.14 111.55,42.14 113.77,39.92 117.11,39.92 117.91,40.72 117.91,41.66 117.26,42.3 117.11,42.3 NMOS2.G
  PWR 0.508: NMOS2.G 115.46,42.49 R_ED_PD.2
  AGROUND 0.254: v105.2,42.14 99.64,47.7 95.2,47.7 91.55,51.35 86.63,51.35 v83.29,54.68
EM_H  (via drill 0.25)
  PWR 0.254: v104.72,34.04 105.28,33.48 NMOS4.G | v79.98,52.69 79.7,52.41 CR1.62
  PWR 0.508: NMOS4.G
  PWR 0.762: NMOS4.G 103.99,28.69 R_EH_PD.2
  AGROUND 0.254: v104.72,34.04 104.42,34.35 104.42,37.13 103.72,37.83 103.72,42.82 100.41,46.13 95.92,46.13 92.61,49.44 83.81,49.44 80.56,52.69 v79.98,52.69
EM_LF  (via drill 0.25)
  PWR 0.254: CR1.58 81.7,52.2 83.74,54.24 83.93,54.24 v83.93,64.05 | v85.36,72.94 85.36,73.41 84.72,74.05 NMOS1.G
  PWR 1.016: NMOS1.G 82.69,74.32 R_ELF_PD.2
  AGROUND 0.254: v85.36,72.94 85.36,65.48 v83.93,64.05
EM_RF  (via drill 0.25)
  PWR 0.254: v85.36,18.96 85.36,18.33 NMOS3.G | CR1.61 80.2,51.95 80.38,52.13 80.38,52.1 v80.36,52.07
  PWR 0.508: NMOS3.G 83.41,18.12 R_ERF_PD.2
  AGROUND 0.254: v85.36,18.96 85.36,21.19 95.04,30.87 95.04,31.5 94.41,32.14 94.41,40.71 96.24,42.55 96.24,45.07 94.44,46.87 94.41,46.87 92.32,48.97 83.46,48.97 v80.36,52.07
GND  (via drill 0.25, 0.3, 0.35, 0.76, 1.02)
  PWR 0.254: B1.2 60.25,71.29 TP13.P$1 | NMOS1.S 84.17,72.87 | CR1.63 79.2,51.62 C4.1 | CR1.31 85.7,36.04 85.69,36.03 85.77,35.96 v85.78,35.96 86.26,35.48 C7.2 | CR1.18 79.2,36.61 | 79.2,36.61 79.2,36.6 | C17.2 78.24,36.26 v78.85,36.26 79.2,36.61 | U$3.GND 20.68,22.78 21.07,22.39 v21.05,22.37 | CR1.47 89.44,46.51 90.82,47.89 90.82,50.97 90.38,51.41 C22.2 | U$22.1 14.07,72.74 U$16.1
  PWR 0.305: 14.05,71 v14.04,70.98 13.94,71.08 14.07,71.22 | U$22.1 13.48,73.34 | 14.69,72.71 14.9,72.71
  PWR 0.508: C_ELF2.2 97.71,70.57 v97.76,70.52 | C_ELF1.2 v97.68,68.52 | TP13.P$1 63.29,71.82 v65.12,73.65 65.63,74.16 v78.63,74.16 80.82,74.16 R_ELF_PD.1 | 6V_PWR.C 12.16,33.41 12.67,33.92 v12.69,33.92 | C_NR.2 12.69,27.14 12.72,27.17 v12.72,27.22 | C_NRST1.2 64.83,28.93 v64.66,28.77 64.59,28.7 B2.1 B2.2 55.63,28.7 55.62,28.69 v55.57,28.69 | C_NRST2.2 64.79,23.1 64.61,22.92 64.55,22.98 B3.1 B3.2 56.7,22.98 v56.08,23.61 | C_EM_D2.2 C_EM_D1.2 116.53,47.72 115.23,46.42 | C7.2 89.53,35.48 C21.1 | B1.1 55.17,59.28 55.21,59.25 55.21,59.22 v55.16,59.17 | C_NRST.2 60.65,58.52 v60.65,59.91 | C_5V1.2 18.26,46.76 v18.26,45.81 | C_5V2.2 20.7,45.96 20.72,45.94 v20.71,45.92 | 3.3V_PWR.C 13.35,37.89 14.06,38.6 v14.06,39.28 | NMOS2.S v115.74,41.19 | NMOS4.S 104.26,27.39 104.26,27.4 v104.16,27.4 | X1.25 7.74,51.27 7.74,52.64 8.04,52.94 8.11,52.94 C_BAT1.2 9.46,54.29 v11.3,54.29 12.29,54.29 v12.31,54.32 12.31,53.57 U$4.GND U$4.EN(BAR) | C_ERF1.2 v91.36,19.47 | C_ERF2.2 93.36,17.59 v93.36,19.45 | R_ERF_PD.1 83.41,21.25 v83.38,21.27 v83.39,21.29 | C_BAT2.2 9.25,45.52 9.21,45.48 9.21,45.45 v9.24,45.43 | NMOS3.S 84.21,16.82 84.19,16.83 v84.09,16.83 | v19.22,20.16 19.14,20.24 C_3.3V1.2
  PWR 0.762: v106.47,57.11 106.47,57.09 C_E_H2.2 106.48,58.73 C_E_H1.2 106.48,61.55 v107.57,62.64 | NMOS1.S 84.27,72.97 v84.27,71.69 | C18.1 C17.2 | U$22.1 14.69,72.71 | 14.07,72.74 14.07,71.22
  PWR 1.016: R_ED_PD.1 115.23,44.4 115.23,46.42 v115.21,46.42 | J2.2 14.04,69.66 v14.04,70.98 | C_EM_D2.2 114.23,52.14 v114.22,52.16 | C_EM_D1.2 116.23,50.38 v114.22,50.38
  GND 0.762: v97.68,68.52 104.29,68.52 107.79,65.01 107.79,62.83 107.59,62.63 v107.57,62.64
  AGROUND 0.508: v21.05,22.37 21.05,21.94 19.25,20.13 v19.22,20.16
  other vias: 102.91,32.22 104.06,32.22 75.53,54.95 76.6,54.98 77.54,54.95 89.76,52.9 87.72,52.9 18.87,40.93 19.93,40.93 18.92,38.62 19.96,38.62 20.19,28.46 20.14,29.6 18.87,29.53 18.94,28.31 64.64,23.05 115.16,50.38 115.11,52.16 13.86,44.36 13.89,43.09 19.2,18.86
  pour AGROUND (rank 2): -3,91.25 135.7,91.25 135.7,-4.75 -3,-4.75
  pour PWR: 11.25,45.12 14.52,45.12 14.52,42.18 11.25,42.18
  pour PWR: 17.24,41.54 17.24,37.73 20.95,37.73 20.95,41.54
  pour PWR: 17.06,37.61 19.3,37.61 19.3,35.32 21.51,35.32 21.51,27.42 16.88,27.42 16.88,30.16 18.18,30.16 18.18,32.7 13.43,32.7 13.43,35.35 17.04,35.35 17.04,37.63
  pour PWR: 74.95,52.16 79.16,52.16 79.16,55.51 74.95,55.51
  pour PWR: 86.71,53.33 91.08,53.33 91.08,50.69 86.71,50.69
  pour PWR: 16.76,21.17 16.76,16.96 19.98,16.96 19.98,21.17
  pour PWR: 12.85,55.1 12.85,53.2 10.84,53.2 10.84,55.13
  pour PWR: 18.71,23.15 19.98,23.15 19.98,22.31 17.8,22.31 17.8,23.18 18.74,23.18
  pour PWR: 11.65,38.9 11.65,35.83 15.03,35.83 15.03,45.3 12.36,45.3 12.36,38.9 11.7,38.9
  pour PWR: 86.99,35.98 90.29,35.98 90.29,33.52 86.99,33.52
  pour AGROUND: 45.43,85.15 45.43,61.51 65.42,61.51 67.51,61.51 67.51,86.53 45.48,86.53 45.48,85.03
  pour GND: -6.23,96.51 138.93,96.51 138.93,-6.01 -6.2,-6.01
  pour PWR: 102.3,32.12 102.3,29.81 104.74,29.81 104.74,32.93 102.38,32.93 102.3,32.93
H2_EM
  PWR 1.016: U$19.- 110.95,27.55 | 110.95,27.55 R_EH1.2 | R_EH2.2 110.95,29.67 110.95,27.55
H_EM  (via drill 1.02)
  PWR 1.016: U$19.+ 113.49,30.91 v111.35,33.06
  AGROUND 1.016: v111.35,33.06 111.35,62.05 U$18.-
I2C_SCL  (via drill 0.25)
  PWR 0.254: U6.23 97.96,45.61 v97.96,45.55 97.55,45.96 94.51,45.96 94.5,45.96 v94.5,45.99 | CR1.29 84.7,32.66 85.36,31.99 85.36,29.1 84.37,28.11 | 84.37,28.11 82.77,26.51 72.91,26.51 R4.1 72.18,27.46 73.75,29.03 v73.75,29.68 | 84.37,28.11 84.58,27.9 v84.73,27.9 | v90.63,28.07 92.58,30.02 92.58,32.6 93.31,33.34 v93.31,34.86
  SIGNAL 0.508: X1.5 54.11,24.05 57.75,20.41 66.8,20.41 67.02,20.64 67.02,22.95 v73.75,29.68
  AGROUND 0.254: v84.73,27.9 84.92,28.08 v90.62,28.08 v90.63,28.07 | v94.5,45.99 94.5,41.46 93.95,40.9 93.95,35.52 93.31,34.89 v93.31,34.86
I2C_SDA  (via drill 0.25)
  PWR 0.254: 69.87,27.16 71.57,25.46 | 71.57,25.46 83.13,25.46 86.07,28.41 86.07,30.44 | CR1.30 85.2,33.17 86.07,32.3 86.07,30.44 | U6.24 96.81,45.37 96.43,45.37 96.37,45.43 94.94,45.43 93.96,44.45 93.96,43.16 92.53,41.73 92.53,33.69 89.27,30.44 86.07,30.44 | v71.7,23.69 71.57,23.81 71.57,25.46
  PWR 0.305: R5.1 69.87,27.16
  SIGNAL 0.508: X1.3 7.7,21.51 9.47,23.28 53.03,23.28 56.94,19.37 67.38,19.37 v71.7,23.69
INT  (via drill 0.25)
  PWR 0.254: U6.12 100.71,39.82 101.37,39.82 v101.39,39.79 | v82.67,47.79 82.67,48.86 CR1.56
  SIGNAL 0.254: v101.39,39.79 101.39,41.97 100.83,42.53 87.72,42.53 82.67,47.59 v82.67,47.79
LF_EM
  PWR 1.016: LEFT_FRONT_EMITTER.- 89.36,74.83 R_ELF.2
M1_A
  PWR 0.381: U2.2 52.5,42.02 51.64,42.88
  PWR 0.508: 39.18,46.94 U$6.1
  PWR 1.016: 51.64,42.88 47.58,46.94
  PWR 1.524: 47.58,46.94 U$6.1
M1_B  (via drill 0.3)
  PWR 0.254: 49.57,41.52 49.57,41.21 50.06,40.72
  PWR 0.305: U2.4 50.06,40.72 | 49.57,41.52 v49.68,41.52
  AGROUND 0.254: 46.6,42.31 46.17,42.31
  AGROUND 0.762: v49.68,41.52 48.89,42.31 46.6,42.31
  AGROUND 1.524: U$6.2 27.22,49.33 28.58,49.33 35.6,42.31 46.17,42.31
M1_ENC_A  (via drill 0.25, 0.35)
  PWR 0.254: CR1.37 90.39,41.51 | 90.39,41.51 90.4,41.5 | 90.39,41.51 91.41,41.51 93.5,43.6 93.5,53.2 94.4,54.1 94.4,56.4 v94.18,56.62 | v46.69,54.54 47.43,55.27 61.52,55.27 65.12,58.87 v66.34,58.87
  PWR 1.016: U$6.4 28.89,54.56 TP7.P$1
  AGROUND 0.254: 94.1,56.7 v94.18,56.62 90.06,60.75 76.26,60.75 76.03,60.52 75.14,60.52 75.12,60.54 68.17,60.54 66.49,58.87 v66.34,58.87 | U$6.4 46.59,54.56 46.65,54.5 v46.69,54.54
M1_ENC_B  (via drill 0.25, 0.35)
  PWR 0.254: CR1.38 90.39,42.01 | 90.39,42.01 90.4,42 | 90.39,42.01 91.11,42.01 92.95,43.85 v92.95,55.37 | v46.14,56.94 54.44,56.94 54.89,56.48 61.52,56.48 64.63,59.6 66.47,59.6 66.95,59.12 v67.71,59.12
  PWR 1.016: U$6.5 30.13,57.1 TP8.P$1
  AGROUND 0.254: v92.95,55.37 92.95,56.49 89.55,59.88 68.47,59.88 v67.71,59.12 | U$6.5 45.98,57.1 v46.14,56.94
M2_A
  PWR 0.381: U2.7 47.67,38.77
  PWR 1.524: 47.67,38.77 26.88,38.77 U$5.1
M2_B  (via drill 0.25)
  PWR 0.305: U2.5 49.82,40.07 48.92,40.98 v48.84,40.98
  AGROUND 0.762: 46.4,40.43 48.28,40.43 v48.84,40.98
  AGROUND 1.524: U$5.2 28.35,36.55 32.23,40.43 46.4,40.43
M2_ENC_A  (via drill 0.25, 0.35)
  PWR 0.254: CR1.40 90.39,43.01 91.93,44.55 91.93,53.4 v91.57,53.76 | v59.45,51.09 64.33,55.97 67.89,55.97 v67.91,55.94
  PWR 1.016: U$5.4 27.14,31.72 TP9.P$1
  AGROUND 0.254: v91.57,53.76 91.05,54.28 91.05,55.84 88.28,58.61 70.58,58.61 v67.91,55.94 | U$5.4 28.34,30.01 48.81,30.01 56.03,37.23 56.03,48.07 58.84,50.89 59.25,50.89 v59.45,51.09
M2_ENC_B  (via drill 0.25, 0.35)
  PWR 0.254: CR1.39 90.39,42.51 | 90.39,42.51 90.74,42.51 92.45,44.22 92.45,54.7 v92.17,54.99 | 90.39,42.51 90.4,42.5 | v60.5,49.87 65.55,54.93 v66.31,54.93
  PWR 1.016: U$5.5 26.99,29.03 TP10.P$1
  AGROUND 0.254: v92.17,54.99 92.12,56.18 89.05,59.25 69.23,59.25 66.31,56.33 v66.31,54.93 | U$5.5 47.85,28.93 | 47.85,28.93 47.87,28.94 | 47.85,28.93 49.5,28.93 57.37,36.79 57.37,47.82 59.38,49.82 60.47,49.82 60.5,49.85 v60.5,49.87
MGND  (via drill 0.51, 1.02)
  PWR 0.305: 59.26,40.7 U2.13 62.62,40.72 62.78,40.88 62.78,41.05 62.86,41.12 62.86,42.64 | 64.08,37.58 63.92,37.69 C_D1.2 62.04,37.52 62.02,37.54 | 62.02,37.54 C_D.2 | 62.02,37.54 61.92,37.59 | 14.9,73.32 15.18,73.6 | 14.9,72.73 14.89,72.72 U$16.2 | 17.55,72.38 16.32,73.6
  PWR 0.762: 14.9,73.32 14.9,72.73
  PWR 1.016: 17.55,72.38 17.55,72.34 | 17.55,72.34 20.38,69.5 | 15.18,73.6 16.32,73.6 16.32,73.56 17.55,72.34
  PWR 1.524: 17.16,72.72 20.38,69.5 21.77,68.11 21.77,64.94 U$6.6 | v24.71,46.04 24.71,44.67 v26.79,42.58
  AGROUND 0.305: 46.61,44.83 v46.58,44.79
  AGROUND 0.508: v58.77,47.16 59.33,47.72 v62.78,47.72 | v59.15,46.22 63.19,46.22 v63.65,46.67 | v60.09,45.38 63.98,45.38 v64.48,45.89
  AGROUND 0.762: v54.86,47.59 46.88,47.59 v44.09,44.79 | v45.36,44.79 46.93,46.37 v54.91,46.37 | v54.88,45.12 54.59,44.83 46.61,44.83
  AGROUND 1.524: U$6.6 26.49,59.06 26.26,59.06 24.5,57.3 24.5,46.04 v24.71,46.04 | U$5.6 26.3,26.97 26.07,26.97 22.9,30.14 22.9,42.08 23.46,42.64 26.77,42.64 26.79,42.61 v26.79,42.58
  pour PWR (rank 2): 25.49,48.25 25.49,24.8 56.2,24.8 56.2,34.48 67.38,34.48 67.38,48.32 25.47,48.32
N$1
  PWR 0.508: R_PWR4.1 7.89,36.53 7.89,37.53 8.25,37.89 3.3V_PWR.A
N$2
  PWR 0.305: U2.3 50.76,41.37 49.14,42.99 R_VM4.1
N$3
  PWR 1.016: J3.2 16.85,64.75 J2.1
N$4
  PWR 1.016: U$15.P$1 80.97,11.57 R_B2.1
N$5
  PWR 0.762: NMOS3.D 87.61,17.04 R_ERF.1
N$6
  PWR 1.016: U$14.P$1 72.12,11.57 R_B1.1
N$7
  PWR 1.016: R_ELF.1 86.77,73.13 NMOS1.D
N$8
  PWR 0.305: U2.6 49.46,39.42 47.95,40.93 R_VM3.1
N$9
  PWR 0.254: 7.93,31.75 7.96,31.78
  PWR 0.508: R_PWR3.1 7.93,30.69 7.93,31.75 | 7.96,31.78 8.25,32.07 6V_PWR.A
N$11
  PWR 0.254: U2.14 59.24,41.41 59.21,41.39 58.47,41.39 58.11,41.03 58.11,39.84 58.41,39.54 59.16,39.54 U2.11
  PWR 0.305: U2.14 61.49,41.37 C_D2.1
N$14
  PWR 0.508: 5V_PWR.A 8.35,43.6 7.87,43.12 7.87,41.72 8.25,41.34 R_PWR1.1
N$18
  PWR 0.508: 118.89,38.07 R_ED2.1
  PWR 1.016: NMOS2.D 118.89,38.07 | R_ED2.1 116.84,38.04 R_ED1.1
N$19
  PWR 1.016: NMOS4.D 107.28,27.95 R_EH1.1 R_EH2.1
N$26
  PWR 1.016: U$3.NR/FB 12.69,23.73 C_NR.1
N$28
  PWR 0.254: U6.10 99,39.23 IMU_C1.1
N$29
  PWR 0.254: IMU_C3.1 99.51,46.13 U6.20
NFAULT  (via drill 0.25)
  PWR 0.254: CR1.54 83.7,52.25 v83.61,52.3 | v60.58,43.49 56.38,43.49 54.88,41.98 54.88,38.65 54.4,38.17 53.61,38.17 U2.8 | v73.93,56.27 v73.93,54.36
  PWR 0.305: U2.8 51.37,38.12 R_VM5.1
  AGROUND 0.254: v60.58,43.49 67.98,43.49 69,42.46 73.13,42.46 75.67,45 75.67,51.51 73.93,53.25 v73.93,54.36 | v73.93,56.27 79.64,56.27 v83.61,52.3
PRGM_1  (via drill 0.25)
  PWR 0.254: CR1.10 79.55,42.51 v79.55,42.53 | v63.7,33.54 62.95,32.8 B2.3 | C_NRST1.1 63.2,32.25 B2.3 | B2.4 B2.3
  GND 0.254: v79.55,42.53 79.55,40.1 73.09,33.64 63.7,33.64 v63.7,33.54
PRGM_2  (via drill 0.25)
  PWR 0.254: CR1.11 78.16,42.01 78.87,41.3 v78.87,41.26 | v55.54,26.99 55.74,26.79 B3.4 B3.3 64.56,26.79 C_NRST2.1
  GND 0.254: v78.87,41.26 78.87,40.18 72.81,34.12 63.45,34.12 63.08,33.75 55.52,33.75 54.22,32.45 54.22,27.98 55.29,26.91 55.46,26.91 v55.54,26.99
REC_LD  (via drill 0.25, 0.35)
  PWR 0.254: CR1.23 81.7,35.49 v81.4,35.19 | 104.25,55.63 104.25,55.95 T3.P$1 106.79,53.46 106.79,53.2 | v112.66,52.62 110.44,52.62 109.85,53.2 106.79,53.2 | 106.79,53.2 106.79,44.68 104.56,42.46 104.56,39.44 96.79,31.66 94.88,31.66 94.72,31.82 v93.45,31.82
  PWR 0.508: U$7.E 115.44,56.32 R_RLD.2
  AGROUND 0.254: v81.4,35.19 84.68,35.19 88,31.87 93.45,31.87 | 93.45,31.87 93.47,31.87 | v112.66,52.62 114.41,54.36 114.41,55.16 115.68,56.43 U$7.E | v93.45,31.82 93.45,31.87
REC_LF  (via drill 0.25)
  PWR 0.254: CR1.22 81.2,36.16 80.32,35.28 v80.16,35.28 | T1.P$1 79.63,78.11 80.65,79.14 80.79,79.14 | 87.71,79.58 87.71,81.52 R_RLF.2 REC_LF.E
  PWR 0.508: REC_LF.E 87.74,81.55 87.71,81.52 | R_RLF.2 87.71,79.58 87.27,79.14 80.79,79.14 79.77,78.11 79.63,78.11 | T1.P$1 77.24,75.73 v77.01,75.73
  SIGNAL 0.254: v93.48,30.55 97.1,30.55 104.67,38.11 104.67,41.85 104.62,41.9 104.62,42.38 104.67,42.43 104.67,51.22 92.09,63.8 91.35,63.8 90.98,64.17 90.98,64.91 85.49,70.4 80.54,70.4 76.98,73.95 76.98,75.73 v77.01,75.73
  AGROUND 0.254: v80.16,35.28 80.16,33.88 80.16,33.87 81.11,32.91 83.48,32.91 85.77,30.62 93.41,30.62 v93.48,30.55
REC_LH  (via drill 0.25)
  PWR 0.254: CR1.8 75.65,43.51 74.62,44.54 73.86,44.54 73.5,44.9 73.5,48.66 72.81,49.34 72.81,51.82 v71.39,53.25
  PWR 0.508: U$21.E 103.26,61.6 R_RLH.2 103.26,61.26 103.26,59.81 101.05,57.59 T2.P$1
  AGROUND 0.254: v71.39,53.25 71.39,57.7 71.7,58.01 80.91,58.01 87.1,51.82 91.71,51.82 102.03,62.14 102.03,62.46 103.29,63.73 U$21.E
REC_RD  (via drill 0.25, 0.35)
  PWR 0.254: CR1.24 82.2,34.9 v81.69,34.39 | v94.41,31.19 97.1,31.19 104.09,38.17 105.36,38.17 T4.P$1
  PWR 0.762: U$8.E 119.23,33.72 R_RRD.2 118.67,33.67 118.67,33.49 117.67,32.49 115.33,32.49 109.48,38.33 107.66,38.33 107.62,38.29 T4.P$1
  AGROUND 0.254: v81.69,34.39 84.54,34.39 87.78,31.15 93.49,31.15 93.61,31.19 v94.41,31.19
REC_RF  (via drill 0.25, 0.35)
  PWR 0.254: CR1.25 82.7,34.5 81.86,33.67 | 81.86,33.67 81.83,33.67 | 81.86,33.67 81.27,33.08 81.27,32.22 80.92,31.87 80.91,31.82 80.87,31.76 v80.87,29.55 | v77.42,24.84 78.05,24.2 78.3,24.15
  PWR 0.508: R_RRF.2 84.72,10.81 | 84.72,10.81 78.3,17.1 78.3,24.15 | U$9.E 87.98,8.67 | T6.P$1 84.72,6.41 84.72,10.81
  PWR 0.762: U$9.E 87.19,9.46 R_RRF.2
  AGROUND 0.254: v77.42,24.84 77.42,27.54 79.64,29.76 80.44,29.76 80.59,29.6 80.75,29.6 v80.87,29.55
REC_RH  (via drill 0.25)
  PWR 0.254: CR1.9 75.44,43.01 74.36,44.08 73.57,44.08 72.66,45 69,45 68.21,44.2 68.21,38.81 70.28,36.74 71.84,36.74 v72.69,35.89 | 99.64,22.14 T5.P$1
  PWR 0.508: U$20.E 108.21,23.3 105.99,25.51 R_RRH.2 102.11,22.18 T5.P$1 | 99.64,22.14 v98.22,20.71
  AGROUND 0.254: v72.69,35.89 73.11,35.47 77.1,35.47 77.19,35.38 80.12,32.46 83.29,32.46 84.56,31.19 84.56,31.03 85.83,29.76 91.55,29.76 92.02,29.28 92.02,28.65 84.72,21.34 84.72,18.64 85.04,18.33 95.83,18.33 v98.22,20.71
RESET  (via drill 0.25)
  PWR 0.254: B1.3 59.09,60.52 | C_NRST.1 58.81,58.34 | C_NRST.1 58.88,58.42 | CR1.7 75.93,44.01 75.02,44.92 75.05,44.95 v75.05,45.2 | v58.97,57.06 C_NRST.1 | C_NRST.1 58.98,58.52 B1.3 | B1.4 B1.3
  AGROUND 0.254: v75.05,45.2 74.16,45.2 62.3,57.06 v58.97,57.06
RF_EM
  PWR 0.508: R_ERF.2
  PWR 1.016: U$13.- 89.74,10.3 R_ERF.2
SPI2_MISO  (via drill 0.25)
  PWR 0.254: CR1.35 89.95,40.51 90.24,40.22 90.25,40.22 90.28,40.19 v90.85,40.19
  SIGNAL 0.254: v90.85,40.19 86.38,40.19 86.23,40.34 9.95,40.34 9.54,40.75 5.47,40.75 4.84,41.39 4.84,42.28 5.92,43.36 X1.21
SPI2_MOSI  (via drill 0.25)
  PWR 0.254: CR1.36 90.56,41.01 v90.67,40.9
  SIGNAL 0.254: X1.19 25.93,41.83 26.32,41.44 27.26,41.44 28.02,42.2 59.62,42.2 60.4,41.42 69.28,41.42 69.7,41.85 89.28,41.85 90.22,40.9 v90.67,40.9
SPI2_NSS  (via drill 0.25)
  PWR 0.254: CR1.33 89.4,39.51 89.94,38.98 v89.94,38.93
  SIGNAL 0.254: X1.24 3.38,45.9 1.84,44.36 1.84,39.3 2.93,38.21 4.83,38.21 4.84,38.2 4.84,36.31 5.69,35.45 27.33,35.45 29.13,37.25 89.2,37.25 90.16,38.22 90.16,38.72 90.14,38.72 v89.94,38.93
SPI2_SCK  (via drill 0.25)
  PWR 0.254: CR1.34 89.81,40.01 90.05,39.77 90.06,39.77 90.37,39.46 91.36,39.46 v91.41,39.51
  SIGNAL 0.254: v91.41,39.51 76.43,39.51 75.36,38.45 74.81,38.45 74.29,38.97 69.73,38.97 69.19,39.51 28.85,39.51 27.33,37.99 5.69,37.99 4.84,38.85 4.84,40.74 4.83,40.75 2.93,40.75 2.3,41.39 2.3,42.28 2.93,42.91 4.83,42.91 4.84,42.93 4.84,44.82 5.92,45.9 X1.23
SWCLK
  PWR 0.254: J1.2 78.76,67.07 81.78,67.07 85.06,63.79 85.06,61.15 86.2,60.01 CR1.49
SWDIO
  PWR 0.254: CR1.46 90.12,46.01 91.46,47.35 91.46,52.41 89.86,54.01 89.86,62.02 83.76,68.11 77.26,68.11 J1.3
  AGROUND 0.254: 75.86,61 75.83,61.03 71.07,61.03 69.96,62.14 69.96,66.27 71.23,67.54 72.97,67.54 74.56,65.95 74.56,65.64 J1.3
USART1_RX  (via drill 0.25)
  PWR 0.254: v90.95,44.74 90.72,44.51 CR1.43
  SIGNAL 0.254: 72.04,62.35 J4.4 82.75,52.26 82.75,51.78 89.1,45.43 | v90.95,44.74 90.95,45.05 90.57,45.43 89.1,45.43 | 88.94,45.43 89.1,45.43
USART1_TX  (via drill 0.25)
  PWR 0.254: CR1.42 90.06,44.01 90.25,43.82 v90.38,43.82
  SIGNAL 0.254: J4.3 82.71,54.84 82.71,54.44 91.53,45.62 91.53,44.5 91.19,44.16 90.72,44.16 v90.38,43.82
V_BATT  (via drill 0.51, 1.02)
  PWR 0.762: C_3.3V7.1 15.98,38.81 16.17,38.81 | v21.06,37.06 20.74,36.74 20.11,36.74 U$23.5 | v78.37,29.6 78.37,30.71 77.58,31.5 77.1,31.5 R_VM1.2
  PWR 1.016: C_3.3V6.1 16.17,40.77 16.17,38.81 U$23.8 16.17,35.97 | C_BAT1.1 9.25,51.38 C_BAT2.1 12.28,49.79 U$4.IN2 U$4.IN1 | 15.94,45.43 15.97,45.43 v15.97,45.53 | v11.91,48.02 11.03,48.02
  PWR 1.524: C_3.3V6.1 15.94,45.43 | 11.03,48.02 C_BAT2.1
  AGROUND 0.762: v15.97,45.53 16.62,45.16 17.09,45.16 21.06,41.19 v21.06,37.06 21.22,36.74 21.22,29.76 26.3,24.68 27.41,24.68 30.75,28.01 48.05,28.01 49.95,26.11 71.7,26.11 75.51,29.92 78.05,29.92 v78.37,29.6
  AGROUND 1.016: 11.93,47.99 v11.91,48.02
  AGROUND 1.524: v15.97,45.53 13.51,47.99 11.93,47.99
  pour PWR (rank 2): 20.08,63.11 20.08,55.36 13.12,55.36 13.12,49.01 7.26,49.01 7.26,63.13
  pour PWR: -0.74,88.33 -0.74,28.08 10.36,28.08 10.36,88.33
VBAT_POWER
  PWR 1.016: J3.1 15.37,59.28 S2.3
VBAT_SENSE
  PWR 0.254: R_VM1.1 76.94,29.95 75.23,31.66 75.23,35.02 77.06,36.84 77.74,36.84 78.53,37.63 CR1.17
  PWR 0.508: R_VM2.2 77.05,29.91 R_VM1.1

## Text on the board
tPlace: 3.3V | GND | UGA 2020 / Robotics Club
tNames: GND | MGND | AGND | 1 | PWR SWITCh | OFF | BAT 1 | RESET | Serial Wire | - | AGND | 2 | + | - | USART | ON | BAT 2 | + | M1 ENC B | MOTOR 1 | IMU | 3 | M1 ENC A | MOTOR CTRL | MGND | 4 | M2 ENC A | Y | Z | X | M2 ENC B | PRGM 1 | MOTOR2 | PRGM 2 | 5 | L | BOOT1 | BOOT0 | 6
bNames: A. Spain
Document: Notes / ----------------------- / Bottom layer - GND / Add net classes / Add power planes / Use vector font
tDocu: Bottom Planes / ------------ / 1. AGND / 2. GND / 3. A3.3V | Top Planes / --------- / 1. 5V, GND / 2.MGND / 3.3.3V / 4. 6V / 5. / 6. V_BATT